# EAGLE design untitled (EAGLE 7.3.0)
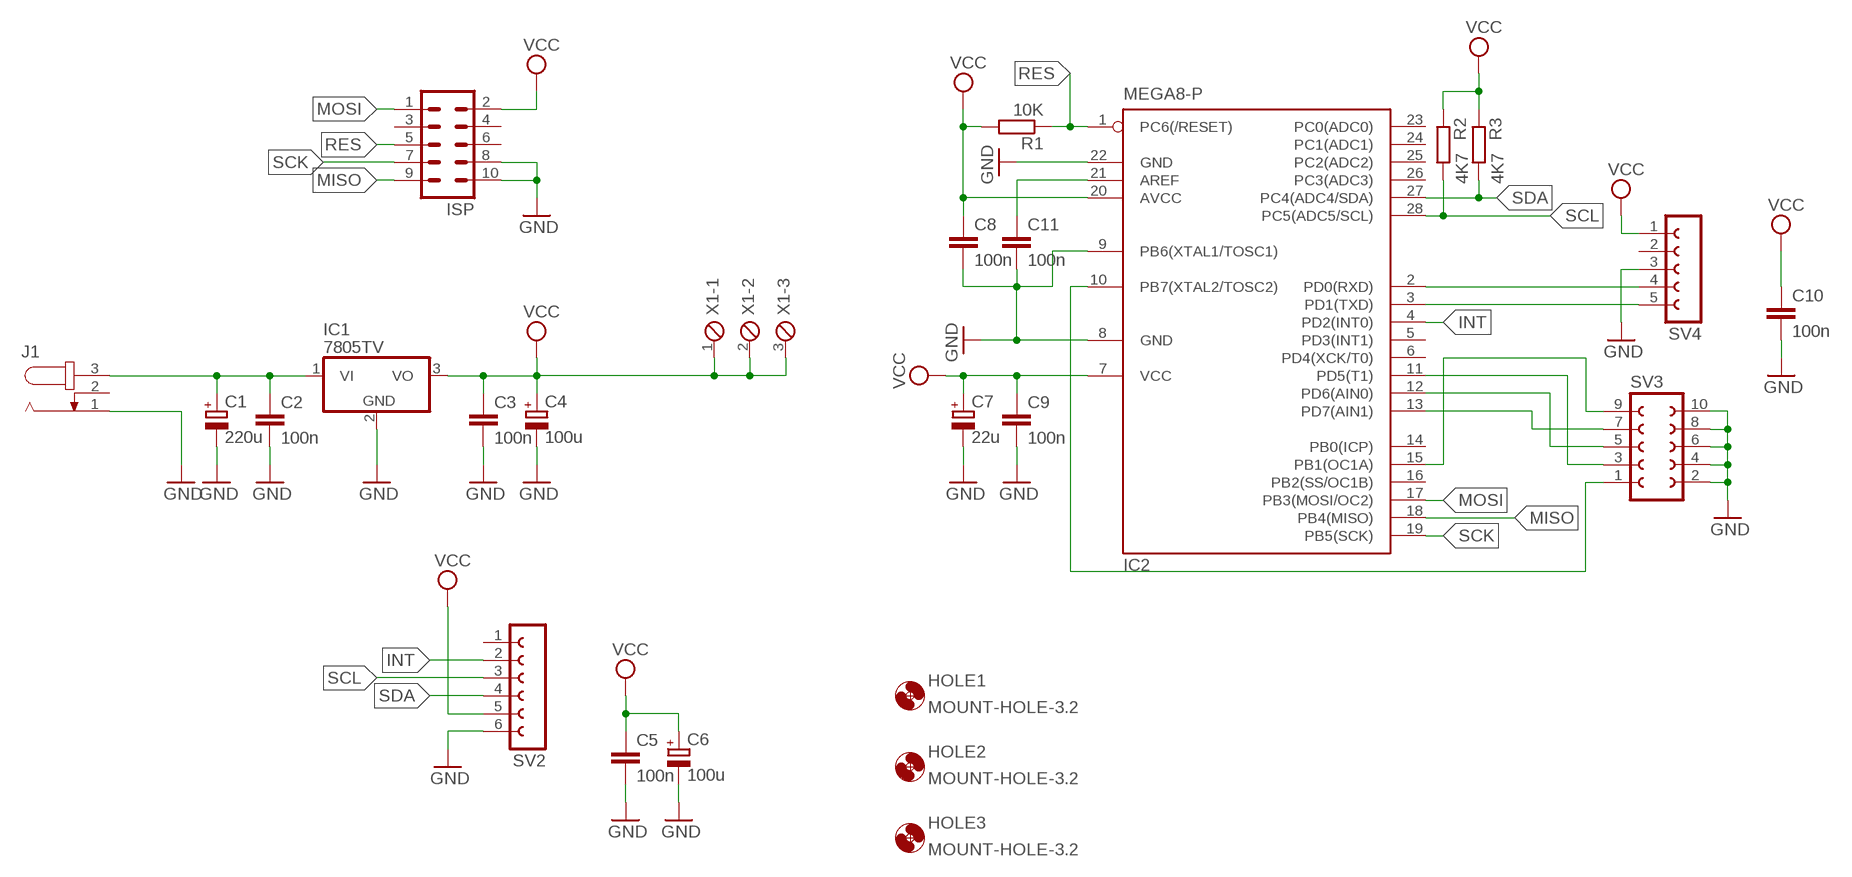
[diagram p0: schematic, sheet 1]

## Parts
C1  220u  CPOL-EUE3.5-8  [E3,5-8]
C2  100n  C-EUC0805  [C0805]
C3  100n  C-EUC0805  [C0805]
C4  100u  CPOL-EUE2.5-5  [E2,5-5]
C5  100n  C-EUC0805  [C0805]
C6  100u  CPOL-EUE2.5-5  [E2,5-5]
C7  22u  CPOL-EUE2.5-5  [E2,5-5]
C8  100n  C-EUC0805  [C0805]
C9  100n  C-EUC0805  [C0805]
C10  100n  C-EUC0805  [C0805]
C11  100n  C-EUC0805  [C0805]
HOLE1  MOUNT-HOLE-3.2  [3,2]
HOLE2  MOUNT-HOLE-3.2  [3,2]
HOLE3  MOUNT-HOLE-3.2  [3,2]
IC1  7805TV  [TO220V]
IC2  MEGA8-P  [DIL28-3]
ISP  ML10  [ML10]
J1  JACK-PLUG1  [SPC4078]
R1  10K  R-EU_R0805  [R0805]
R2  4K7  R-EU_R0805  [R0805]
R3  4K7  R-EU_R0805  [R0805]
SV2  FE06-1  [FE06]
SV3  FE05-2  [FE05-2]
SV4  FE05-1  [FE05-1]
X1  MPT3  [3POL254]

## Nets
GND: C1.- C2.2 C3.2 C4.- C5.2 C6.- C7.- C8.2 C9.2 C10.2 C11.2 IC1.2(GND) IC2.8(GND) IC2.9(PB6(XTAL1/TOSC1)) IC2.22(GND) ISP.8 ISP.10 J1.1 SV2.6 SV3.2 SV3.4 SV3.6 SV3.8 SV3.10 SV4.3
INT: IC2.4(PD2(INT0)) SV2.2
MISO: IC2.18(PB4(MISO)) ISP.9
MOSI: IC2.17(PB3(MOSI/OC2)) ISP.1
N$1: C1.+ C2.1 IC1.1(VI) J1.3
N$2: C11.1 IC2.21(AREF)
N$4: IC2.2(PD0(RXD)) SV4.4
N$5: IC2.3(PD1(TXD)) SV4.5
N$6: IC2.10(PB7(XTAL2/TOSC2)) SV3.1
N$8: IC2.15(PB1(OC1A)) SV3.9
N$9: IC2.13(PD7(AIN1)) SV3.7
N$10: IC2.12(PD6(AIN0)) SV3.5
N$11: IC2.11(PD5(T1)) SV3.3
RES: IC2.1(PC6(/RESET)) ISP.5 R1.1
SCK: IC2.19(PB5(SCK)) ISP.7
SCL: IC2.28(PC5(ADC5/SCL)) R2.2 SV2.3
SDA: IC2.27(PC4(ADC4/SDA)) R3.2 SV2.4
VCC: C3.1 C4.+ C5.1 C6.+ C7.+ C8.1 C9.1 C10.1 IC1.3(VO) IC2.7(VCC) IC2.20(AVCC) ISP.2 R1.2 R2.1 R3.1 SV2.5 SV4.1 X1.1 X1.2 X1.3
Unconnected: IC2.5(PD3(INT1)) IC2.6(PD4(XCK/T0)) IC2.14(PB0(ICP)) IC2.16(PB2(SS/OC1B)) IC2.23(PC0(ADC0)) IC2.24(PC1(ADC1)) IC2.25(PC2(ADC2)) IC2.26(PC3(ADC3)) ISP.3 ISP.4 ISP.6 J1.2 SV2.1 SV4.2

## Library data of the parts
C1 C4 C6 C7 = rcl:CPOL-EU: POLARIZED CAPACITOR, European symbol
C2 C3 C5 C8-C11 = rcl:C-EU: CAPACITOR, European symbol
HOLE1-HOLE3 = holes:MOUNT-HOLE-: MOUNTING HOLE with drill center marker; BOM: EXCLUDE
IC1 = linear:78*: Positive VOLTAGE REGULATOR Source: http://cache.national.com/ds/LM/LM78L05.pdf http://www.fairchildsemi.com/ds/LM/LM7805.pdf
IC2 = atmel:MEGA8-P: MICROCONTROLLER 8 Kbytes FLASH, 1 kbytes SRAM, 512 bytes EEPROM, USART, 4-channel 10 bit ADC, 2-channel 8 bit ADC Pin compatible with Atmega48, ATMega88, ATMega168 Source: avr.lbr; OC_FARNELL: unknown; OC_NEWARK: unknown
ISP = con-harting-ml:ML10: HARTING; OC_FARNELL: unknown; OC_NEWARK: unknown
J1 = con-jack:JACK-PLUG: DC POWER JACK Power Jack, DC, Right Angle, Through Hole, Rated 5A at 16VDC, PC Terminals Distributor: Farnell (www.Farnell.de) Drawing: 84N1161.pdf / 84N1162.pdf Manufacturer: SPC Technology (www.spctechnology.com) Type: SPC4077 / SPC 4078; OC_FARNELL: unknown; OC_NEWARK: unknown
R1-R3 = rcl:R-EU_: RESISTOR, European symbol
SV2 = con-lsta:FE06-1: FEMALE HEADER; OC_FARNELL: unknown; OC_NEWARK: unknown
SV3 = con-lsta:FE05-2: FEMALE HEADER; OC_FARNELL: unknown; OC_NEWARK: unknown
SV4 = con-lsta:FE05-1: FEMALE HEADER; OC_FARNELL: unknown; OC_NEWARK: unknown
X1 = con-phoenix-254:MPT3: PHOENIX CONNECTOR; OC_FARNELL: unknown; OC_NEWARK: unknown

## Board
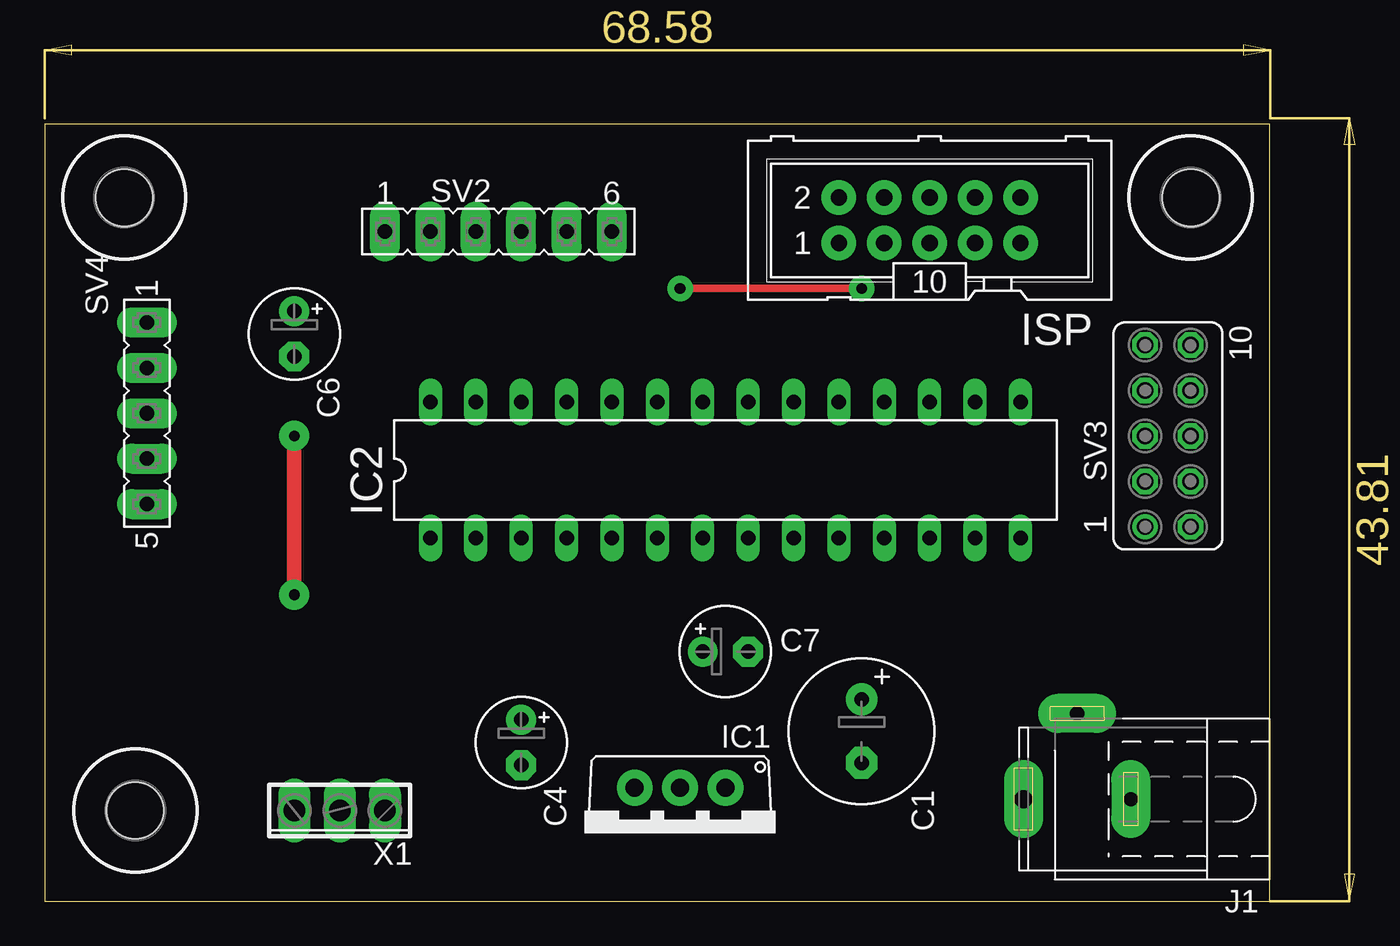
[diagram p1: board, top side]
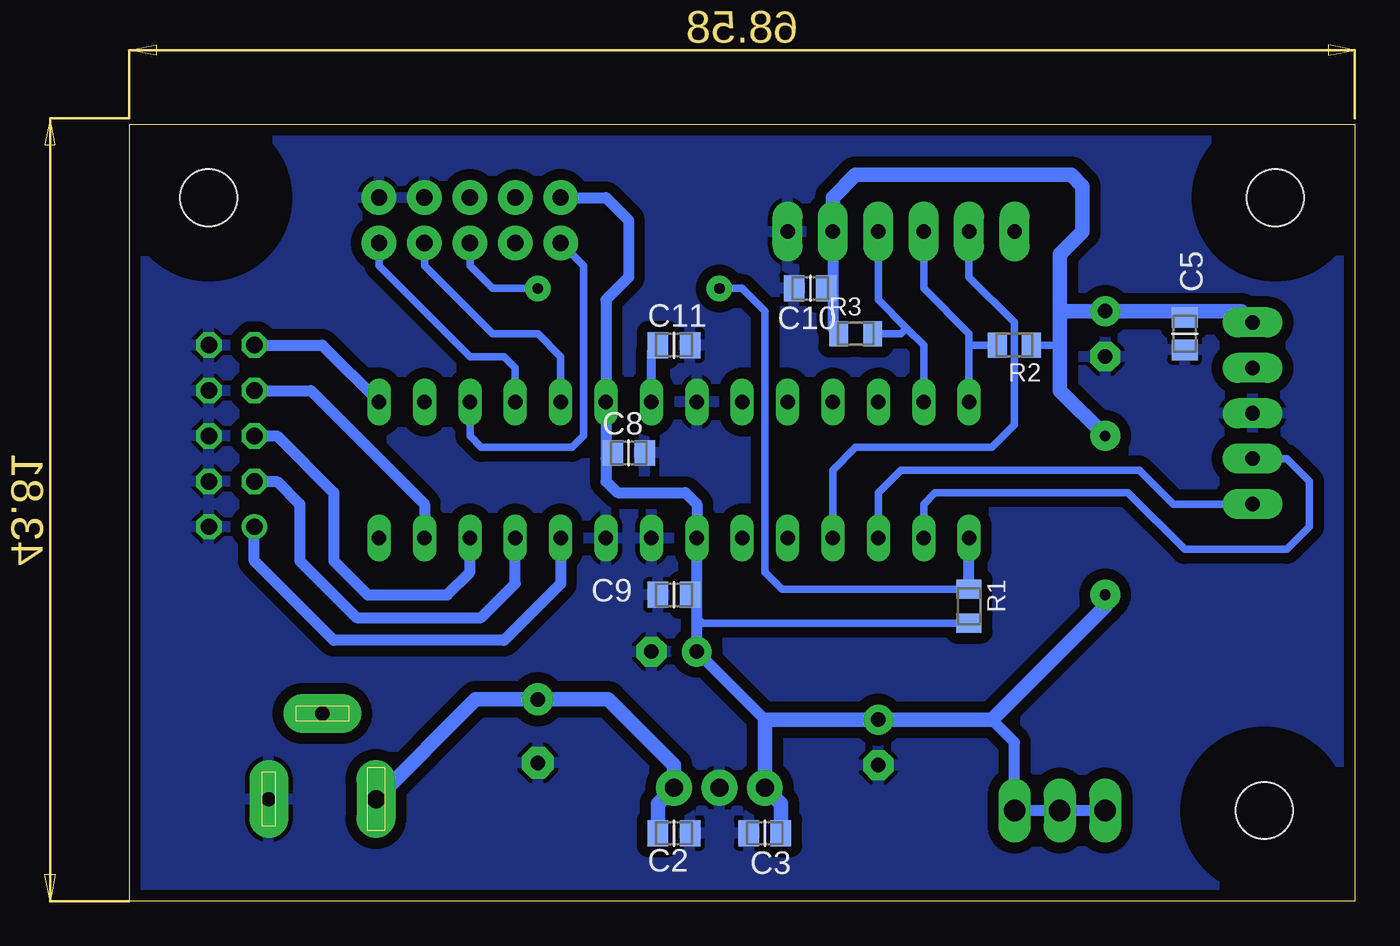
[diagram p2: board, bottom side, seen from below]

Size 68.56 x 43.48 mm. Coordinates in mm from the lower left corner, seen from the top.
Outline: 0,0 68.56,0 68.56,43.48 0,43.48 0,0
Copper layers (1*16): Top 0.035mm / dielectric 1.5mm / Bottom 0.035mm
Design rules "default *": minimum track width 10mil, minimum drill 24mil, track to track 8mil, track to pad 8mil, pad to pad 8mil, via to via 8mil, smd to smd 8mil, copper to edge 4mil, drill to drill 8mil, minimum pad ring 10mil, minimum via ring 8mil, stop-mask expansion 4mil, vias tented up to drill 0mil, thermal gap 10mil

### Footprints (pad centres in the part's own frame; a part is rotated, then mirrored left to right if it is on the bottom)
E3,5-8 = drill 0.813 pad 1.778: + -1.778,0 | drill 0.813 pad 1.778 octagon: - 1.778,0
C0805 = smd 1.15 x 1.45: 1 -0.9,0; 2 0.9,0
E2,5-5 = drill 0.813 pad 1.676: + -1.27,0 | drill 0.813 pad 1.676 octagon: - 1.27,0
3,2 = hole 3.2: 0,0
TO220V = drill 1.016 pad 2: 1 -2.54,-2.54; 2 0,-2.54; 3 2.54,-2.54
DIL28-3 = drill 0.813 long: 1 -16.51,-3.81; 2 -13.97,-3.81; 3 -11.43,-3.81; 4 -8.89,-3.81; 5 -6.35,-3.81; 6 -3.81,-3.81; 7 -1.27,-3.81; 8 1.27,-3.81; 9 3.81,-3.81; 10 6.35,-3.81; 11 8.89,-3.81; 12 11.43,-3.81; 13 13.97,-3.81; 14 16.51,-3.81; 15 16.51,3.81; 16 13.97,3.81; 17 11.43,3.81; 18 8.89,3.81; 19 6.35,3.81; 20 3.81,3.81; 21 1.27,3.81; 22 -1.27,3.81; 23 -3.81,3.81; 24 -6.35,3.81; 25 -8.89,3.81; 26 -11.43,3.81; 27 -13.97,3.81; 28 -16.51,3.81
ML10 = drill 0.914 pad 1.93: 1 -5.08,-1.27; 2 -5.08,1.27; 3 -2.54,-1.27; 4 -2.54,1.27; 5 0,-1.27; 6 0,1.27; 7 2.54,-1.27; 8 2.54,1.27; 9 5.08,-1.27; 10 5.08,1.27
SPC4078 = drill 0.8 pad 2.184 long: 1 -3,0; 2 0,-4.8 | drill 1 pad 2.184 long: 3 3,0
R0805 = smd 1.05 x 1.4: 1 -0.95,0; 2 0.95,0
FE06 = drill 0.813 pad 1.676 long: 1 -6.35,0; 2 -3.81,0; 3 -1.27,0; 4 1.27,0; 5 3.81,0; 6 6.35,0
FE05-2 = drill 0.914: 1 -5.08,1.27 | drill 0.914 octagon: 2 -5.08,-1.27; 3 -2.54,1.27; 4 -2.54,-1.27; 5 0,1.27; 6 0,-1.27; 7 2.54,1.27; 8 2.54,-1.27; 9 5.08,1.27; 10 5.08,-1.27
FE05-1 = drill 0.813 pad 1.676 long: 1 -5.08,0; 2 -2.54,0; 3 0,0; 4 2.54,0; 5 5.08,0
3POL254 = drill 1.2 long: 1 -2.54,0; 2 0,0; 3 2.54,0

### Placement (x,y rotation side)
C1  45.72,9.53 270 top
C2  38.1,3.81 0 bottom
C3  33.02,3.81 180 bottom
C4  26.67,8.89 270 top
C5  9.53,31.75 270 bottom
C6  13.97,31.75 270 top
C7  38.1,13.97 0 top
C8  40.64,25.08 0 bottom
C9  38.1,17.14 180 bottom
C10  30.48,34.29 180 bottom
C11  38.1,31.11 0 bottom
HOLE1  5.08,5.08 0 top
HOLE2  64.14,39.37 0 top
HOLE3  4.45,39.37 0 top
IC1  35.56,3.81 180 top
IC2  38.1,24.13 0 top
ISP  49.53,38.1 0 top
J1  57.78,5.71 180 top
R1  21.59,16.51 270 bottom
R2  19.05,31.11 180 bottom
R3  27.94,31.75 0 bottom
SV2  25.4,37.47 0 top
SV3  62.87,26.04 90 top
SV4  5.71,27.3 270 top
X1  16.51,5.08 180 top

### Tracks (layer width: path | path; a pad name or v marks a point on that pad's centre or on a via)
GND
  pour Bottom (isolate 0.61): 0,43.81 68.58,43.81 68.58,0 0,0
INT
  Bottom 0.406: SV2.2 21.59,34.92 19.05,32.38 19.05,26.67 20.32,25.4 27.94,25.4 29.21,24.13 IC2.4
MISO
  Bottom 0.406: IC2.18 46.99,29.84 47.62,30.48 49.53,30.48 54.61,35.56 ISP.9
MOSI
  Bottom 0.406: IC2.17 49.53,26.04 48.9,25.4 43.81,25.4 43.18,26.04 43.18,35.56 ISP.1
N$1
  Bottom 0.813: C2.1 39,5.45 IC1.1 38.1,7.62 41.78,11.3 C1.+ 49.2,11.3 J1.3
N$2
  Bottom 0.508: IC2.21 39.37,30.75 C11.1
N$4
  Bottom 0.406: SV4.4 3.81,24.77 2.54,23.5 2.54,20.95 3.81,19.68 9.53,19.68 12.7,22.86 23.5,22.86 24.13,22.23 IC2.2
N$5
  Bottom 0.406: IC2.3 26.67,22.86 25.4,24.13 12.06,24.13 10.16,22.23 SV4.5
N$6
  Bottom 0.61: IC2.10 44.45,17.78 47.62,14.61 57.15,14.61 61.59,19.05 SV3.1
N$8
  Bottom 0.61: SV3.9 57.78,31.11 IC2.15
N$9
  Bottom 0.61: SV3.7 58.42,28.57 52.07,22.23 IC2.13
N$10
  Bottom 0.61: SV3.5 60.33,26.04 57.15,22.86 57.15,19.05 55.24,17.14 50.8,17.14 49.53,18.41 IC2.12
N$11
  Bottom 0.61: SV3.3 60.33,23.5 59.05,22.23 59.05,19.05 55.88,15.88 48.9,15.88 46.99,17.78 IC2.11
RES  (via drill 0.6 pad 1.42)
  Top 0.406: v45.72,34.29 v35.56,34.29
  Bottom 0.406: v35.56,34.29 34.29,34.29 33.02,33.02 33.02,18.41 32.06,17.46 R1.1 | v45.72,34.29 48.26,34.29 49.53,35.56 ISP.5
  Bottom 0.61: R1.1 IC2.1
SCK
  Bottom 0.406: IC2.19 44.45,30.48 45.72,31.75 48.26,31.75 52.07,35.56 ISP.7
SCL
  Bottom 0.406: SV2.3 24.13,34.29 21.59,31.75 21.59,31.11 | 21.59,31.11 IC2.28 | R2.2 21.59,31.11
SDA
  Bottom 0.406: SV2.4 26.67,33.66 25.08,32.07 | 25.08,32.07 24.13,31.11 IC2.27 | R3.2 25.4,31.75 25.08,32.07
VCC  (via drill 0.6 pad 1.68)
  Top 0.813: v13.97,17.14 v13.97,26.04
  Bottom 0.406: R1.2 36.52,15.56 36.83,15.88 | R2.1 16.51,31.11
  Bottom 0.61: 29.21,38.47 SV2.5 29.21,34.29 | 36.83,17.14 36.83,15.88 C7.+ 33.02,10.16 | 36.83,17.14 IC2.7 36.83,22.23 37.47,22.86 41.27,22.86 41.91,23.5 41.91,24.77 | C9.1 36.83,17.14 | X1.3 X1.2 X1.1 19.05,8.89 20.32,10.16 | 41.91,24.77 IC2.20 41.91,33.66 40.64,34.92 40.64,38.1 41.91,39.37 ISP.2 | C8.1 41.91,24.77 | 29.21,34.29 29.21,32.07 R3.1 | C10.1 29.21,34.29
  Bottom 0.813: C3.1 32.12,5.45 IC1.3 33.02,10.16 C4.+ 20.32,10.16 13.97,16.51 v13.97,17.14 | 9.53,33.02 C6.+ 16.51,33.02 | 9.53,33.02 6.35,33.02 SV4.1 | C5.1 9.53,33.02 | 16.51,33.02 16.51,36.2 15.24,37.47 15.24,40.01 15.88,40.64 27.94,40.64 29.21,39.37 SV2.5 | 16.51,33.02 16.51,31.11 16.51,28.57 v13.97,26.04